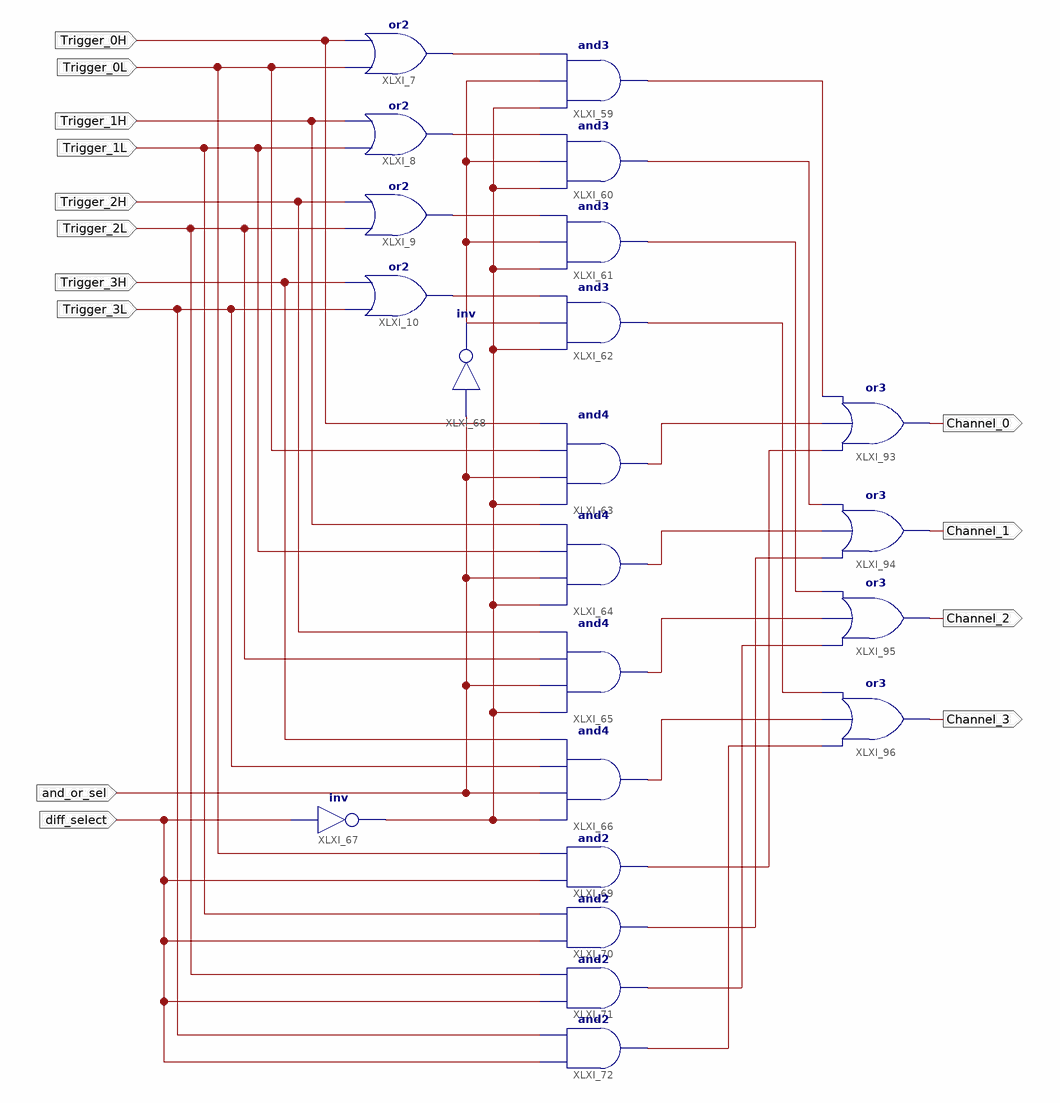
[diagram p0: schematic sheet 1]
// Xilinx ISE schematic trigger_ch.sch (spartan3a) as structural Verilog: 22 symbols, 14 ports
module trigger_ch (
  input  Trigger_1L,
  input  Trigger_0H,
  input  Trigger_0L,
  input  Trigger_2H,
  input  Trigger_2L,
  input  Trigger_3H,
  input  Trigger_3L,
  input  and_or_sel,
  input  diff_select,
  input  Trigger_1H,
  output Channel_0,
  output Channel_1,
  output Channel_2,
  output Channel_3
);

  wire XLXN_53, XLXN_54, XLXN_55, XLXN_56, XLXN_159, XLXN_160, XLXN_196, XLXN_197, XLXN_198, XLXN_199,
       XLXN_200, XLXN_201, XLXN_202, XLXN_203, XLXN_204, XLXN_205, XLXN_206, XLXN_207;

  or XLXI_7 (XLXN_53, Trigger_0L, Trigger_0H);
  or XLXI_8 (XLXN_54, Trigger_1L, Trigger_1H);
  or XLXI_9 (XLXN_55, Trigger_2L, Trigger_2H);
  or XLXI_10 (XLXN_56, Trigger_3L, Trigger_3H);
  and XLXI_63 (XLXN_197, XLXN_160, and_or_sel, Trigger_0L, Trigger_0H);
  and XLXI_64 (XLXN_202, XLXN_160, and_or_sel, Trigger_1L, Trigger_1H);
  and XLXI_65 (XLXN_203, XLXN_160, and_or_sel, Trigger_2L, Trigger_2H);
  and XLXI_66 (XLXN_204, XLXN_160, and_or_sel, Trigger_3L, Trigger_3H);
  not XLXI_67 (XLXN_160, diff_select);
  not XLXI_68 (XLXN_159, and_or_sel);
  and XLXI_69 (XLXN_198, diff_select, Trigger_0L);
  and XLXI_70 (XLXN_205, diff_select, Trigger_1L);
  and XLXI_71 (XLXN_206, diff_select, Trigger_2L);
  and XLXI_72 (XLXN_207, diff_select, Trigger_3L);
  and XLXI_59 (XLXN_196, XLXN_160, XLXN_159, XLXN_53);
  and XLXI_60 (XLXN_199, XLXN_160, XLXN_159, XLXN_54);
  and XLXI_61 (XLXN_200, XLXN_160, XLXN_159, XLXN_55);
  and XLXI_62 (XLXN_201, XLXN_160, XLXN_159, XLXN_56);
  or XLXI_93 (Channel_0, XLXN_198, XLXN_197, XLXN_196);
  or XLXI_94 (Channel_1, XLXN_205, XLXN_202, XLXN_199);
  or XLXI_95 (Channel_2, XLXN_206, XLXN_203, XLXN_200);
  or XLXI_96 (Channel_3, XLXN_207, XLXN_204, XLXN_201);
endmodule
